# EAGLE design LED (EAGLE 7.6.0)
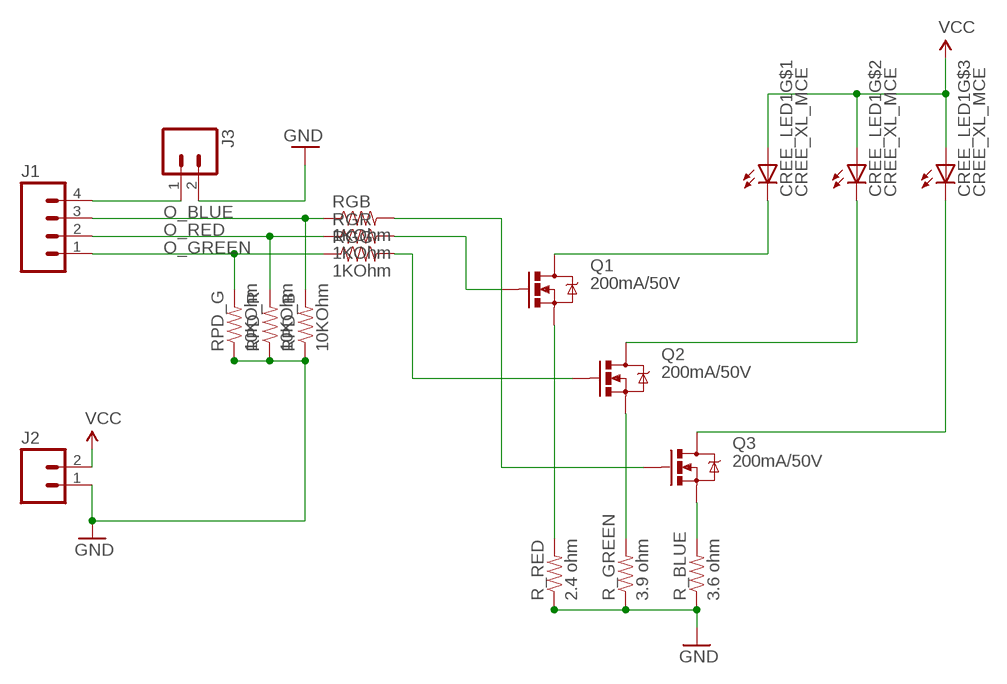
[diagram p0: schematic, sheet 1]

## Parts
CREE_LED1  CREE_XL_MCE  [CREE_XL_MCE]
J1  M04NO_SILK_ALL_ROUND  [1X04_NO_SILK_ALL_ROUND]
J2  M021X02_NO_SILK  [1X02_NO_SILK]
J3  M021X02_NO_SILK  [1X02_NO_SILK]
Q1  200mA/50V  MOSFET-NCHANNELBSS138  [SOT23-3]
Q2  200mA/50V  MOSFET-NCHANNELBSS138  [SOT23-3]
Q3  200mA/50V  MOSFET-NCHANNELBSS138  [SOT23-3]
R_BLUE  3.6 ohm  RESISTOR0805-RES  [0805]
R_GREEN  3.9 ohm  RESISTOR0805-RES  [0805]
R_RED  2.4 ohm  RESISTOR0805-RES  [0805]
RGB  1KOhm  RESISTOR0805-RES  [0805]
RGG  1KOhm  RESISTOR0805-RES  [0805]
RGR  1KOhm  RESISTOR0805-RES  [0805]
RPD_B  10KOhm  RESISTOR0805-RES  [0805]
RPD_G  10KOhm  RESISTOR0805-RES  [0805]
RPD_R  10KOhm  RESISTOR0805-RES  [0805]

## Nets
GND: J2.1 J3.2 R_BLUE.1 R_GREEN.1 R_RED.1 RPD_B.1 RPD_G.1 RPD_R.1
N$1 [SUPPLY]: Q3.2(S) R_BLUE.2
N$2 [SUPPLY]: Q2.2(S) R_GREEN.2
N$3 [SUPPLY]: Q1.2(S) R_RED.2
N$4: Q2.1(G) RGG.2
N$5: Q1.1(G) RGR.2
N$6: Q3.1(G) RGB.2
N$7: J1.4 J3.1
N$9 [SUPPLY]: CREE_LED1.6(C) Q3.3(D)
N$10 [SUPPLY]: CREE_LED1.8(C) Q1.3(D)
N$11 [SUPPLY]: CREE_LED1.7(C) Q2.3(D)
O_BLUE: J1.3 RGB.1 RPD_B.2
O_GREEN: J1.1 RGG.1 RPD_G.2
O_RED: J1.2 RGR.1 RPD_R.2
VCC [SUPPLY]: CREE_LED1.1(A) CREE_LED1.2(A) CREE_LED1.3(A) J2.2
Unconnected: CREE_LED1.4(A) CREE_LED1.5(C) CREE_LED1.HT(TH:TH)

## Library data of the parts
CREE_LED1 = CreeXL-MC-E:CREE_XL_MCE: Cree® LED
J1 = SparkFun-Connectors:M04: Header 4 Standard 4-pin 0.1" header. Use with straight break away headers (SKU : PRT-00116), right angle break away headers (PRT-00553), swiss pins (PRT-00743), machine pins (PRT-00117), and female headers (PRT-00115). Molex polarized connector foot print use with SKU : PRT-08231 with associated crimp pins and housings. 1MM SMD Version SKU: PRT-10208; PROD_ID: CONN-09696
J2 J3 = SparkFun-Connectors:M02: Standard 2-pin 0.1" header. Use with - straight break away headers ( PRT-00116) - right angle break away headers (PRT-00553) - swiss pins (PRT-00743) - machine pins (PRT-00117) - female headers (PRT-00115) Molex polarized connector foot print use with: PRT-08233 with associated crimp pins and housings. 2.54_SCREWTERM for use with PRT-10571. 3.5mm Screw Terminal footprints for PRT-08084 5mm Screw Terminal footprints for use with PRT-08432
Q1-Q3 = SparkFun-DiscreteSemi:MOSFET-NCHANNEL: Common NMOSFET Parts MFG P/N Store ID Prod ID FDD8780 TRANS-09984 SI7820DN TRANS-11055 FDS6630A IC-08089 2N7002PW TRANS-11151 FQP30N06L COM-10213 TRANS-10060 BSS123LT1G TRANS-08345 BSS138 TRANS-00830 BS170 2N7000; PROD_ID: TRANS-00830
R_BLUE R_GREEN R_RED RGB RGG RGR RPD_B RPD_G RPD_R = SparkFun-Resistors:RESISTOR: Resistor Basic schematic elements and footprints for 0603, 1206, and PTH resistors.

## Net classes
0 default: width 0.3 mm
1 GND: width 0.5 mm, clearance 0.5 mm
2 SUPPLY: width 0.5 mm, clearance 0.003 mm

## Board
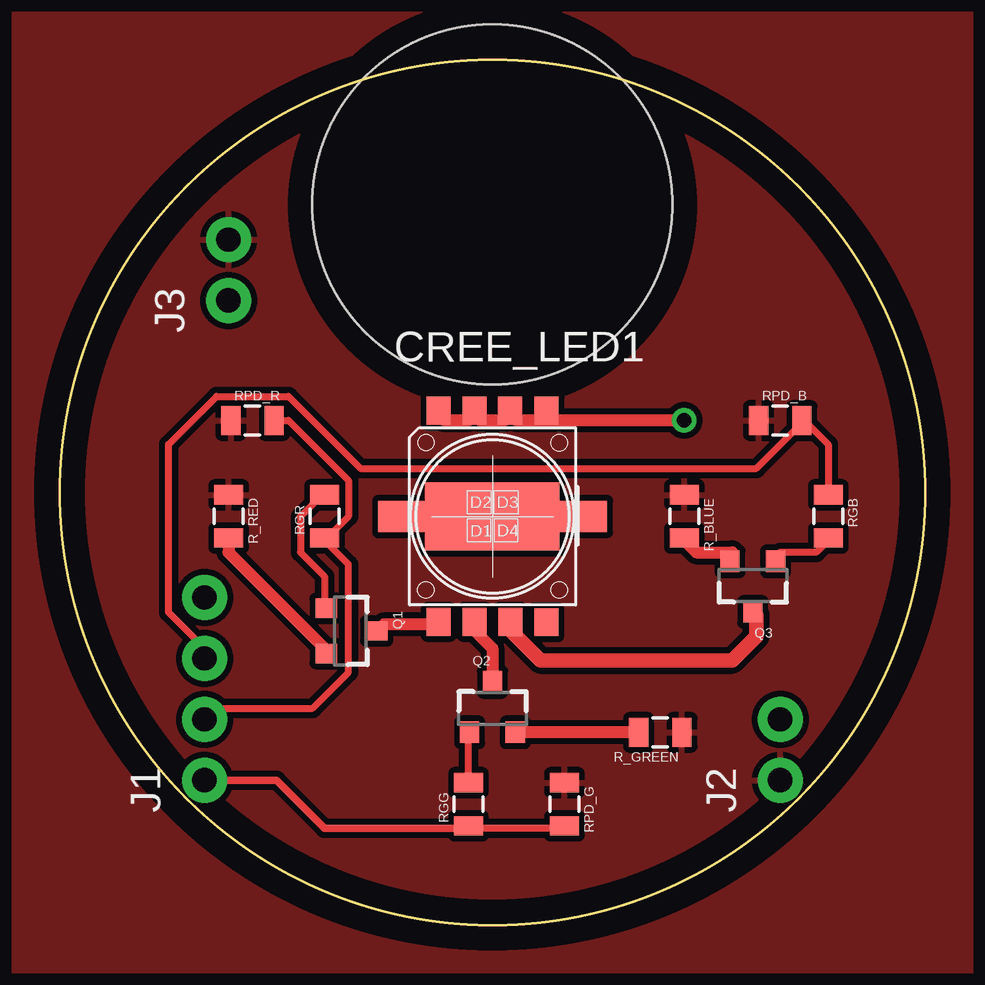
[diagram p1: board, top side]
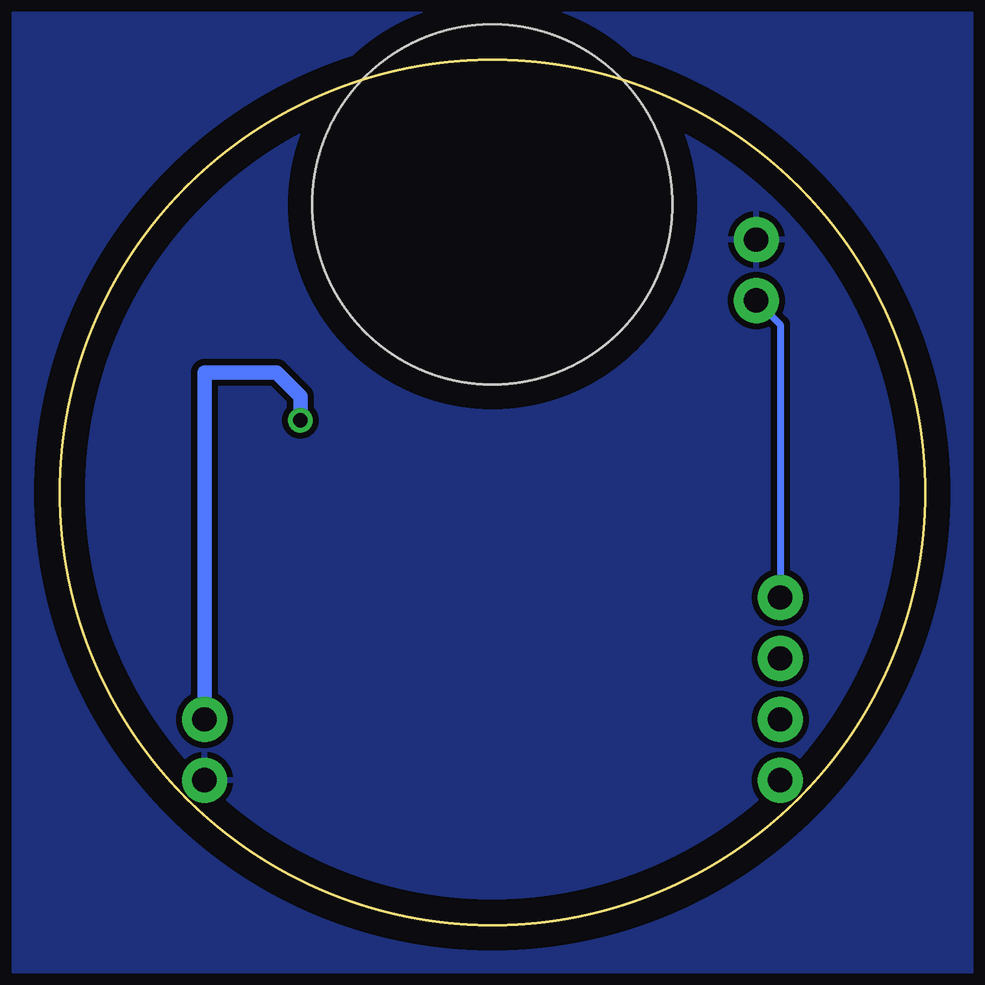
[diagram p2: board, bottom side, seen from below]

Size 36.06 x 36.06 mm. Coordinates in mm from the lower left corner, seen from the top.
Outline: circle at 18.03,18.03 radius 18.03
Copper layers (1*16): Top 0.035mm / dielectric 1.5mm / Bottom 0.035mm
Design rules "baballe": minimum track width 5mil, minimum drill 24mil, track to track 4mil, track to pad 4mil, pad to pad 4mil, via to via 4mil, smd to smd 2mil, copper to edge 40mil, drill to drill 8mil, minimum pad ring 10mil, minimum via ring 8mil, stop-mask expansion 4mil, vias tented up to drill 0mil, thermal gap 10mil
Holes 15 mm at 18.03,30.03

### Footprints (pad centres in the part's own frame; a part is rotated, then mirrored left to right if it is on the bottom)
CREE_XL_MCE = smd 1 x 1.16: 1 -2.24,4.42; 2 -0.739,4.408; 3 0.739,4.408; 4 2.256,4.408; 5 2.246,-4.408; 6 0.749,-4.399; 7 -0.739,-4.399; 8 -2.237,-4.399 | smd 5.6 x 2.84: HT 0,0 | smd 2 x 1.3: P$9 3.778,0; P$10 -3.767,0
1X04_NO_SILK_ALL_ROUND = drill 1.016 pad 1.88: 1 0,0; 2 2.54,0; 3 5.08,0; 4 7.62,0
1X02_NO_SILK = drill 1.016 pad 1.88: 1 0,0; 2 2.54,0
SOT23-3 = smd 0.8 x 0.9: 1 -0.95,-1; 2 0.95,-1; 3 0,1.1
0805 = smd 0.8 x 1.2: 1 -0.9,0; 2 0.9,0

### Placement (x,y rotation side)
CREE_LED1  18.03,17.03 0 top
J1  6.03,6.03 90 top
J2  30.03,6.03 90 top
J3  7.03,26.03 90 top
Q1  12.1,12.25 270 top
Q2  18.03,9.03 0 top
Q3  28.88,14.15 180 top
R_BLUE  26.03,17.03 270 top
R_GREEN  25.03,8.03 180 top
R_RED  7.03,17.03 270 top
RGB  32.03,17.03 270 top
RGG  17.03,5.03 90 top
RGR  11.03,17.03 90 top
RPD_B  30.03,21.03 0 top
RPD_G  21.03,5.03 270 top
RPD_R  8.03,21.03 0 top

### Tracks (layer width: path | path; a pad name or v marks a point on that pad's centre or on a via)
GND
  pour Top (isolate 0.254): -0.97,38.03 38.03,38.03 38.03,-1.97 -1.97,-1.97 -1.97,38.03
  pour Bottom (isolate 0.254): -0.97,38.03 38.03,38.03 38.03,-1.97 -1.97,-1.97 -1.97,38.03
N$1
  Top 0.5: Q3.2 28.03,15.53 26.53,15.53 26.03,16.03 R_BLUE.2
N$2
  Top 0.5: R_GREEN.2 Q2.2
N$3
  Top 0.5: R_RED.2 7.03,15.53 11.03,11.53 Q1.2
N$4
  Top 0.3: RGG.2 17.03,8.03 Q2.1
N$5
  Top 0.3: Q1.1 11.03,13.53 11.03,14.53 10.03,15.53 10.03,17.03 11.03,18.03 RGR.2
N$6
  Top 0.3: Q3.1 30.03,15.53 31.53,15.53 32.03,16.03 RGB.2
N$7
  Bottom 0.3: J1.4 6.03,25.03 J3.1
N$9
  Top 0.61: CREE_LED1.6 18.78,12.28 20.03,11.03 28.03,11.03 29.03,12.03 29.03,12.91 Q3.3
N$10
  Top 0.5: Q1.3 13.53,12.53 15.53,12.53 CREE_LED1.8
N$11
  Top 0.5: Q2.3 18.03,11.53 17.03,12.53 CREE_LED1.7
O_BLUE
  Top 0.3: RGB.1 32.03,20.03 31.03,21.03 | 31.03,21.03 29.03,19.03 12.53,19.03 9.53,22.03 6.53,22.03 4.53,20.03 4.53,13.03 6.03,11.53 J1.3 | 31.03,21.03 RPD_B.2
O_GREEN
  Top 0.3: RGG.1 17.03,4.03 21.03,4.03 RPD_G.2
  Top 0.305: 17.03,4.03 11.03,4.03 9.03,6.03 J1.1
O_RED
  Top 0.3: 11.03,16.03 12.03,17.03 12.03,18.53 9.53,21.03 RPD_R.2 | 11.03,16.03 12.03,15.03 12.03,10.53 10.53,9.03 6.03,9.03 J1.2 | 11.03,16.03 RGR.1
VCC  (via drill 0.61)
  Top 0.5: CREE_LED1.1 16.03,21.03 17.03,21.03 CREE_LED1.2 17.53,21.03 18.53,21.03 CREE_LED1.3 19.03,21.03 v26.03,21.03
  Bottom 0.5: 30.03,9.03 J2.2
  Bottom 0.61: 30.03,9.03 30.03,23.03 27.03,23.03 26.03,22.03 v26.03,21.03